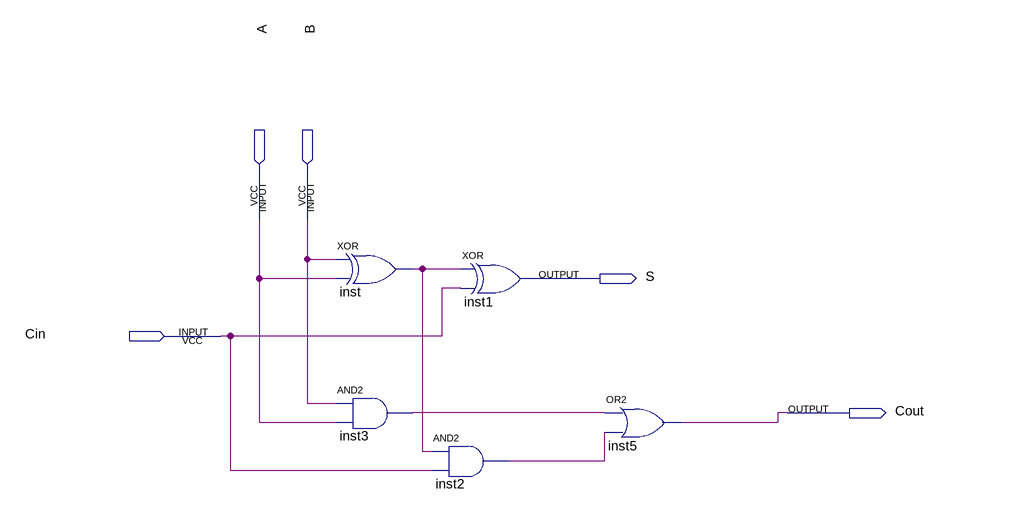
[diagram p0: schematic sheet]
// Quartus schematic FullAdder.bdf as structural Verilog: 5 symbols, 5 pins
module FullAdder (
  input  A,
  input  B,
  input  Cin,
  output S,
  output Cout
);

  wire inst2_out, inst3_out, inst_out;

  xor inst (inst_out, B, A);
  and inst3 (inst3_out, B, A);
  xor inst1 (S, inst_out, Cin);
  and inst2 (inst2_out, inst_out, Cin);
  or inst5 (Cout, inst3_out, inst2_out);
endmodule
